# Altium schematic sheet Undervoltage.SchDoc
size A; SheetNumber: 4; SheetTotal: 4
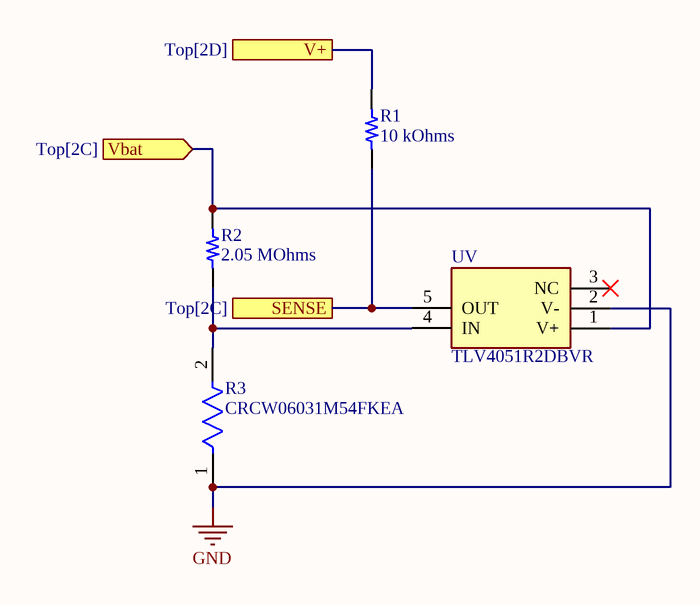
[diagram p0: Undervoltage.SchDoc]

## Parts
R1  value 10 kOhms  [RES 0603_1608]  (hidden comment: RR0816P-103-D)
R2  value 2.05 MOhms  [RES 0603_1608]  (hidden comment: RMCF0603FT2M05)
R3  CRCW06031M54FKEA  [FP-CRCW0603-e3-IPC_B]
UV  TLV4051R2DBVR  [SOT95P280X145-5N]

## Ports
SENSE (see Top[2C]), V+ (see Top[2D]), Vbat (in, see Top[2C])

## Nets
GND: R3.1 UV.2(V-)
SENSE: R1.1 UV.5(OUT) ; port SENSE
V+: R1.2 ; port V+
Vbat: R2.2 UV.1(V+) ; port Vbat
NetR2_1: R2.1 R3.2 UV.4(IN)

Not connected (* = marked no-connect by the designer): UV 3(NC)*

## Library data of the parts
R1 = CMP-289-000281-1: RES SMD 10K OHM 0.5% 1/16W 0603; Manufacturer: Susumu; Power (Watts): 0.063W, 1/16W; Temperature Coefficient: ±25ppm/°C; Device Package: 0603 (1608 Metric); Resistance: 10 kOhms; Number of Terminations: 2; Height - Seated (Max): 0.020" (0.50mm); Composition: Thin Film; Size / Dimension: 0.063" L x 0.031" W (1.60mm x 0.80mm); Series: RR; PartId: 5458; Supplier Device Package: 0603; Part Number: RR0816P-103-D; ComponentLink1Description: Datasheet; Minimum Order: 1; Packaging: TapeAndReel; ComponentLink1URL: http://www.susumu.co.jp/common/pdf/n_catalog_partition05_en.pdf; ComponentLink2URL: https://www.digikey.com/en/products/detail/susumu/RR0816P-103-D/432209; Price: 0.01; LastUpdated: 9/19/2022 1:22:32 PM; Package / Case: 0603 (1608 Metric); Tolerance: ±0.5%; ComponentLink2Description: DigiKey Link; Lifecycle Status: Active; Part Status: Active; Operating Temperature: -55°C ~ 125°C
R2 = CMP-289-001020-1: RES 2.05M OHM 1% 1/10W 0603; Manufacturer: Stackpole Electronics Inc; Power (Watts): 0.1W, 1/10W; Temperature Coefficient: ±200ppm/°C; Series: RMCF; Part Number: RMCF0603FT2M05; Lifecycle Status: Active; Device Package: 0603 (1608 Metric); Number of Terminations: 2; ComponentLink2Description: DigiKey Link; Price: 0.01; Minimum Order: 1; Part Status: Active; Resistance: 2.05 MOhms; Ratings: AEC-Q200; PartId: 6967; Features: Automotive AEC-Q200; ComponentLink2URL: https://www.digikey.com/en/products/detail/stackpole-electronics-inc/RMCF0603FT2M05/1713706; LastUpdated: 9/19/2022 1:22:26 PM; ComponentLink1URL: https://www.seielect.com/catalog/sei-rmcf_rmcp.pdf; Composition: Thick Film; ComponentLink1Description: Datasheet; Supplier Device Package: 0603; Size / Dimension: 0.061" L x 0.031" W (1.55mm x 0.80mm); Height - Seated (Max): 0.022" (0.55mm); Package / Case: 0603 (1608 Metric); Operating Temperature: -55°C ~ 155°C; Packaging: CutTape; Tolerance: ±1%
R3 = CMP-02407-002537-1: RES Thick Film, 1.54MΩ, 1%, 0.1W, 100ppm/°C, 0603; Voltage Rating: 75V; Max Power Dissipation: 100mW; Resistance: 1.54MR; Min Operating Temperature: -55°C; Height: 0.02inch; Composition: Thick Film; Weight: 7.1E-05oz; Width: 0.85mm; Depth: 0.85mm; Case Code (Imperial): 0603; Power Rating: 100mW; Contact Plating: Tin; Packaging: Tape and Reel; Lead Free: Lead Free; Length: 1.55mm; Tolerance: 1%; Package Quantity: 10; Temperature Coefficient: 100ppm/°C; Features: Automotive AEC-Q200; Case/Package: 0603; Military Standard: Not; Number of Pins: 2; Termination: SMD/SMT; Number of Terminations: 2; Max Operating Temperature: 155°C; Case Code (Metric): 1608; Radiation Hardening: No; Voltage Rating (DC): 75V
UV = TLV4051R2DBVR: Integrated Circuit; Manufacturer_Name: Texas Instruments; Datasheet Link: https://www.ti.com/product/TLV4051; Height: 1.45mm; Manufacturer_Part_Number: TLV4051R2DBVR